# EAGLE design 2364 (EAGLE 6.6.0)
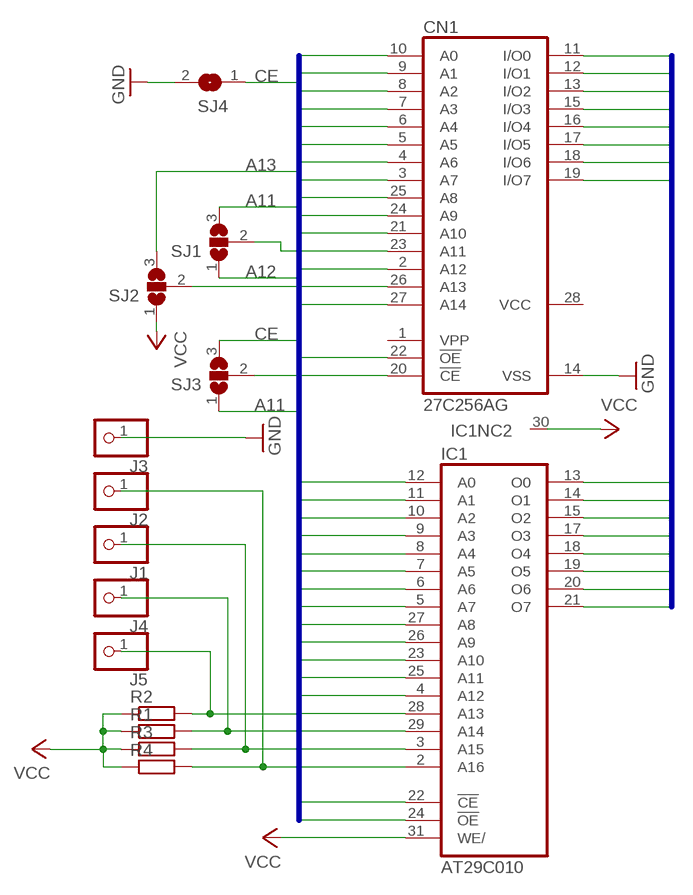
[diagram p0: schematic, sheet 1]

## Parts
CN1  27C256AG  [DIL28-6]
IC1  AT29C010  AM29F010P  [DIL32-3]
J1  PINHD-1X1  [1X01]
J2  PINHD-1X1  [1X01]
J3  PINHD-1X1  [1X01]
J4  PINHD-1X1  [1X01]
J5  PINHD-1X1  [1X01]
R1  R-EU_M0805  [M0805]
R2  R-EU_M0805  [M0805]
R3  R-EU_M0805  [M0805]
R4  R-EU_M0805  [M0805]
SJ1  SJ2W  [SJ_2]
SJ2  SJ2W  [SJ_2]
SJ3  SJ2W  [SJ_2]
SJ4  SJ  [SJ]

## Nets
A0: CN1.10(A0) IC1.12(A0)
A1: CN1.9(A1) IC1.11(A1)
A2: CN1.8(A2) IC1.10(A2)
A3: CN1.7(A3) IC1.9(A3)
A4: CN1.6(A4) IC1.8(A4)
A5: CN1.5(A5) IC1.7(A5)
A6: CN1.4(A6) IC1.6(A6)
A7: CN1.3(A7) IC1.5(A7)
A8: CN1.25(A8) IC1.27(A8)
A9: CN1.24(A9) IC1.26(A9)
A10: CN1.21(A10) IC1.23(A10)
A11: IC1.25(A11) SJ1.3 SJ3.1
A12: CN1.2(A12) IC1.4(A12) SJ1.1
A13: IC1.28(A13) J5.1 R2.2 SJ2.3
A14: CN1.27(A14) IC1.29(A14) J4.1 R1.2
CE: IC1.22(!CE) SJ3.3 SJ4.1
D0: CN1.11(I/O0) IC1.13(O0)
D1: CN1.12(I/O1) IC1.14(O1)
D2: CN1.13(I/O2) IC1.15(O2)
D3: CN1.15(I/O3) IC1.17(O3)
D4: CN1.16(I/O4) IC1.18(O4)
D5: CN1.17(I/O5) IC1.19(O5)
D6: CN1.18(I/O6) IC1.20(O6)
D7: CN1.19(I/O7) IC1.21(O7)
GND: CN1.14(VSS) J3.1 SJ4.2
N$1: IC1.2(A16) J2.1 R4.2
N$2: IC1.3(A15) J1.1 R3.2
N$3: CN1.23(A11) SJ1.2
N$4: CN1.26(A13) SJ2.2
N$5: CN1.20(!CE) SJ3.2
OE: CN1.22(!OE) IC1.24(!OE)
VCC: IC1.30(NC) IC1.31(WE/) R1.1 R2.1 R3.1 R4.1 SJ2.1
Unconnected: CN1.1(VPP) IC1.1(NC)

## Buses
D[0..7]
A[0..14],OE,CE

## Power pins joined to a net without a drawn wire
GND: IC1.16(GND)
VCC: CN1.28(VCC) IC1.32(VCC)

## Library data of the parts
CN1 = memory-hitachi:27C256AG: MEMORY
IC1 = am29-memory:AM29F010*: 1-Megabit FLASH MEMORY (128 K x 8 bit) 5 V-only
J1-J5 = pinhead:PINHD-1X1: PIN HEADER
R1-R4 = rcl:R-EU_: RESISTOR, European symbol
SJ1-SJ3 = jumper:SJ2W: SMD solder JUMPER
SJ4 = jumper:SJ: SMD solder JUMPER

## Board
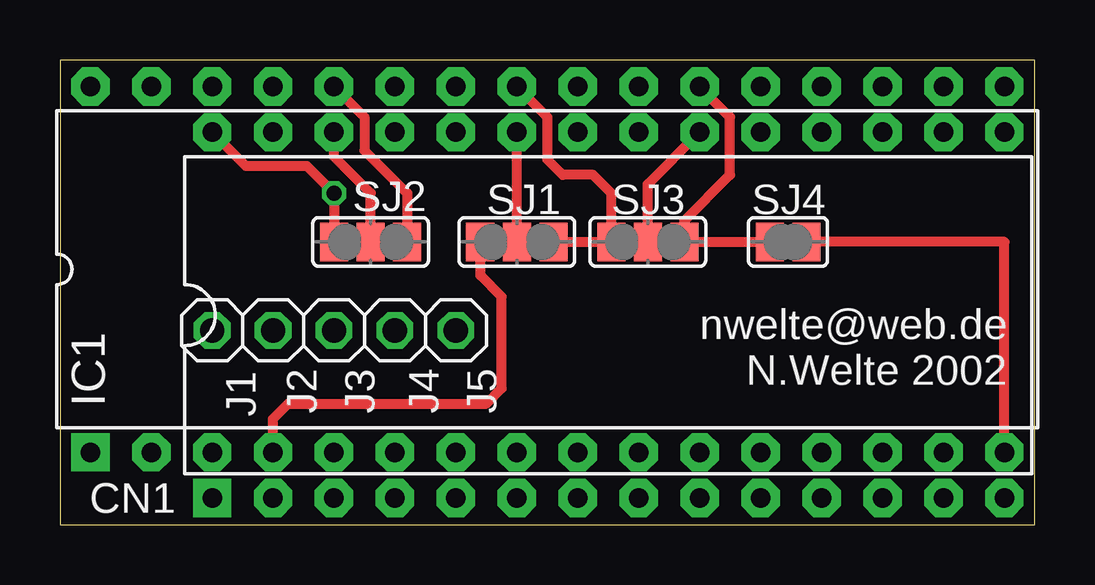
[diagram p1: board, top side]
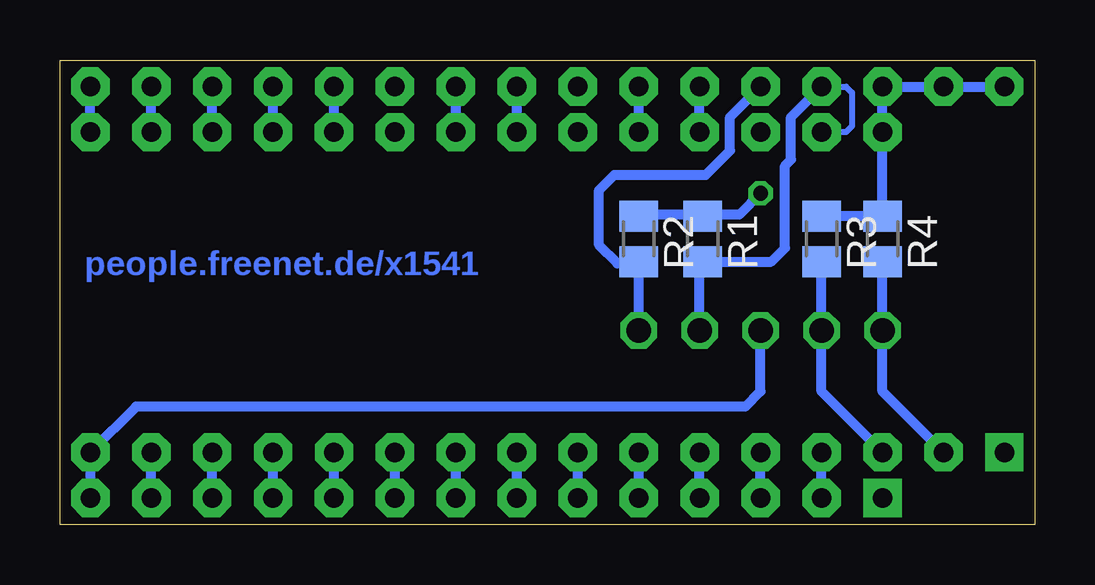
[diagram p2: board, bottom side, seen from below]

Size 40.63 x 19.36 mm. Coordinates in mm from the lower left corner, seen from the top.
Outline: 40.63,0 40.63,19.36 0,19.36 0,0 40.63,0
Copper layers (1*16): Top 0.035mm / dielectric 1.5mm / Bottom 0.035mm
Design rules "default *": minimum track width 10mil, minimum drill 24mil, track to track 8mil, track to pad 8mil, pad to pad 8mil, via to via 8mil, smd to smd 8mil, copper to edge 10mil, drill to drill 8mil, minimum pad ring 10mil, minimum via ring 8mil, stop-mask expansion 4mil, vias tented up to drill 0mil, thermal gap 10mil

### Footprints (pad centres in the part's own frame; a part is rotated, then mirrored left to right if it is on the bottom)
DIL28-6 = drill 0.813 pad 1.6 square: 1 -16.51,-7.62 | drill 0.813 pad 1.6 octagon: 2 -13.97,-7.62; 3 -11.43,-7.62; 4 -8.89,-7.62; 5 -6.35,-7.62; 6 -3.81,-7.62; 7 -1.27,-7.62; 8 1.27,-7.62; 9 3.81,-7.62; 10 6.35,-7.62; 11 8.89,-7.62; 12 11.43,-7.62; 13 13.97,-7.62; 14 16.51,-7.62; 15 16.51,7.62; 16 13.97,7.62; 17 11.43,7.62; 18 8.89,7.62; 19 6.35,7.62; 20 3.81,7.62; 21 1.27,7.62; 22 -1.27,7.62; 23 -3.81,7.62; 24 -6.35,7.62; 25 -8.89,7.62; 26 -11.43,7.62; 27 -13.97,7.62; 28 -16.51,7.62
DIL32-3 = drill 0.813 pad 1.6 square: 1 -19.05,-3.81 | drill 0.813 pad 1.6 octagon: 2 -16.51,-3.81; 3 -13.97,-3.81; 4 -11.43,-3.81; 5 -8.89,-3.81; 6 -6.35,-3.81; 7 -3.81,-3.81; 8 -1.27,-3.81; 9 1.27,-3.81; 10 3.81,-3.81; 11 6.35,-3.81; 12 8.89,-3.81; 13 11.43,-3.81; 14 13.97,-3.81; 15 16.51,-3.81; 16 19.05,-3.81; 17 19.05,11.43; 18 16.51,11.43; 19 13.97,11.43; 20 11.43,11.43; 21 8.89,11.43; 22 6.35,11.43; 23 3.81,11.43; 24 1.27,11.43; 25 -1.27,11.43; 26 -3.81,11.43; 27 -6.35,11.43; 28 -8.89,11.43; 29 -11.43,11.43; 30 -13.97,11.43; 31 -16.51,11.43; 32 -19.05,11.43
1X01 = drill 1.016 octagon: 1 0,0
M0805 = smd 1.3 x 1.6: 1 -0.95,0; 2 0.95,0
SJ_2 = smd 1.168 x 1.6: 1 -1.524,0; 2 0,0; 3 1.524,0
SJ = smd 1.168 x 1.6: 1 -0.762,0; 2 0.762,0

### Placement (x,y rotation side)
CN1  22.85,8.72 0 top
IC1  20.31,6.82 0 top
J1  8.88,8.09 90 top
J2  6.35,8.09 90 top
J3  11.43,8.09 90 top
J4  13.96,8.09 90 top
J5  16.5,8.09 90 top
R1  13.84,11.9 270 bottom
R2  16.5,11.9 270 bottom
R3  8.88,11.9 270 bottom
R4  6.35,11.9 270 bottom
SJ1  19.04,11.77 0 top
SJ2  12.95,11.77 0 top
SJ3  24.51,11.77 0 top
SJ4  30.35,11.77 0 top

### Tracks (layer width: path | path; a pad name or v marks a point on that pad's centre or on a via)
A0
  Bottom 0.406: CN1.10 IC1.12
A1
  Bottom 0.406: CN1.9 IC1.11
A2
  Bottom 0.406: CN1.8 IC1.10
A3
  Bottom 0.406: CN1.7 IC1.9
A4
  Bottom 0.406: CN1.6 IC1.8
A5
  Bottom 0.406: CN1.5 IC1.7
A6
  Bottom 0.406: CN1.4 IC1.6
A7
  Bottom 0.406: CN1.3 IC1.5
A8
  Bottom 0.406: CN1.25 IC1.27
A9
  Bottom 0.406: CN1.24 IC1.26
A10
  Bottom 0.406: CN1.21 IC1.23
A11
  Top 0.406: SJ1.3 SJ3.1 22.98,13.8 22.22,14.57 20.95,14.57 20.31,15.2 20.31,16.98 IC1.25
A12
  Top 0.406: SJ1.1 17.52,10.38 18.41,9.49 18.41,5.68 17.77,5.04 9.52,5.04 8.88,4.41 IC1.4
  Bottom 0.406: CN1.2 IC1.4
A13
  Top 0.406: SJ2.3 14.47,13.8 12.7,15.58 12.7,16.98 IC1.28
  Bottom 0.406: 16.5,11.01 R2.2 16.5,10.88 | J5.1 16.5,10.88 | IC1.28 12.7,16.98 12.7,15.58 13.71,14.57 17.52,14.57 18.16,13.93 18.16,11.65 17.39,10.88 16.5,10.88
A14
  Bottom 0.254: CN1.27 7.87,16.34 7.62,16.6 7.62,18 7.87,18.25 IC1.29
  Bottom 0.406: R1.2 13.84,11.01 | J4.1 13.96,10.95 R1.2 | R1.2 10.98,10.95 10.41,11.52 10.41,14.95 10.16,15.2 10.16,16.98 IC1.29
CE
  Top 0.406: IC1.22 27.93,16.98 27.93,14.57 26.03,12.66 SJ3.3 SJ4.1
D0
  Bottom 0.406: CN1.11 IC1.13
D1
  Bottom 0.406: CN1.12 IC1.14
D2
  Bottom 0.406: CN1.13 IC1.15
D3
  Bottom 0.406: CN1.15 IC1.17
D4
  Bottom 0.406: CN1.16 IC1.18
D5
  Bottom 0.406: CN1.17 IC1.19
D6
  Bottom 0.406: CN1.18 IC1.20
D7
  Bottom 0.406: CN1.19 IC1.21
GND
  Top 0.406: SJ4.2 39.37,11.77 IC1.16
  Bottom 0.406: J3.1 11.43,5.55 12.06,4.92 37.46,4.92 IC1.16 CN1.14
N$1
  Bottom 0.406: J2.1 R4.2 J2.1 | IC1.2 6.35,5.55 J2.1
N$2
  Bottom 0.406: R3.2 8.88,8.22 J1.1 8.88,5.55 IC1.3
N$3
  Top 0.406: SJ1.2 CN1.23
N$4
  Top 0.406: SJ2.2 12.95,13.8 11.43,15.33 CN1.26
N$5
  Top 0.406: SJ3.2 24.51,14.19 CN1.20
OE
  Bottom 0.406: CN1.22 IC1.24
VCC  (via drill 0.61)
  Top 0.406: SJ2.1 v11.43,13.8 10.28,14.95 7.74,14.95 CN1.28
  Bottom 0.406: IC1.32 IC1.31 IC1.30 CN1.28 6.35,12.92 | R4.1 6.35,12.92 | 6.35,12.92 6.41,12.85 R3.1 8.88,12.79 | 13.84,12.79 R1.1 13.84,12.92 | R2.1 16.5,12.92 13.84,12.92 | v11.43,13.8 12.31,12.92 13.84,12.92

### Text on the board
Bottom: people.freenet.de/x1541
tNames: nwelte@web.de | N.Welte 2002